# EasyEDA Pro project 1 Port AC Power Switch.eprj, board Single Port PCB Pro
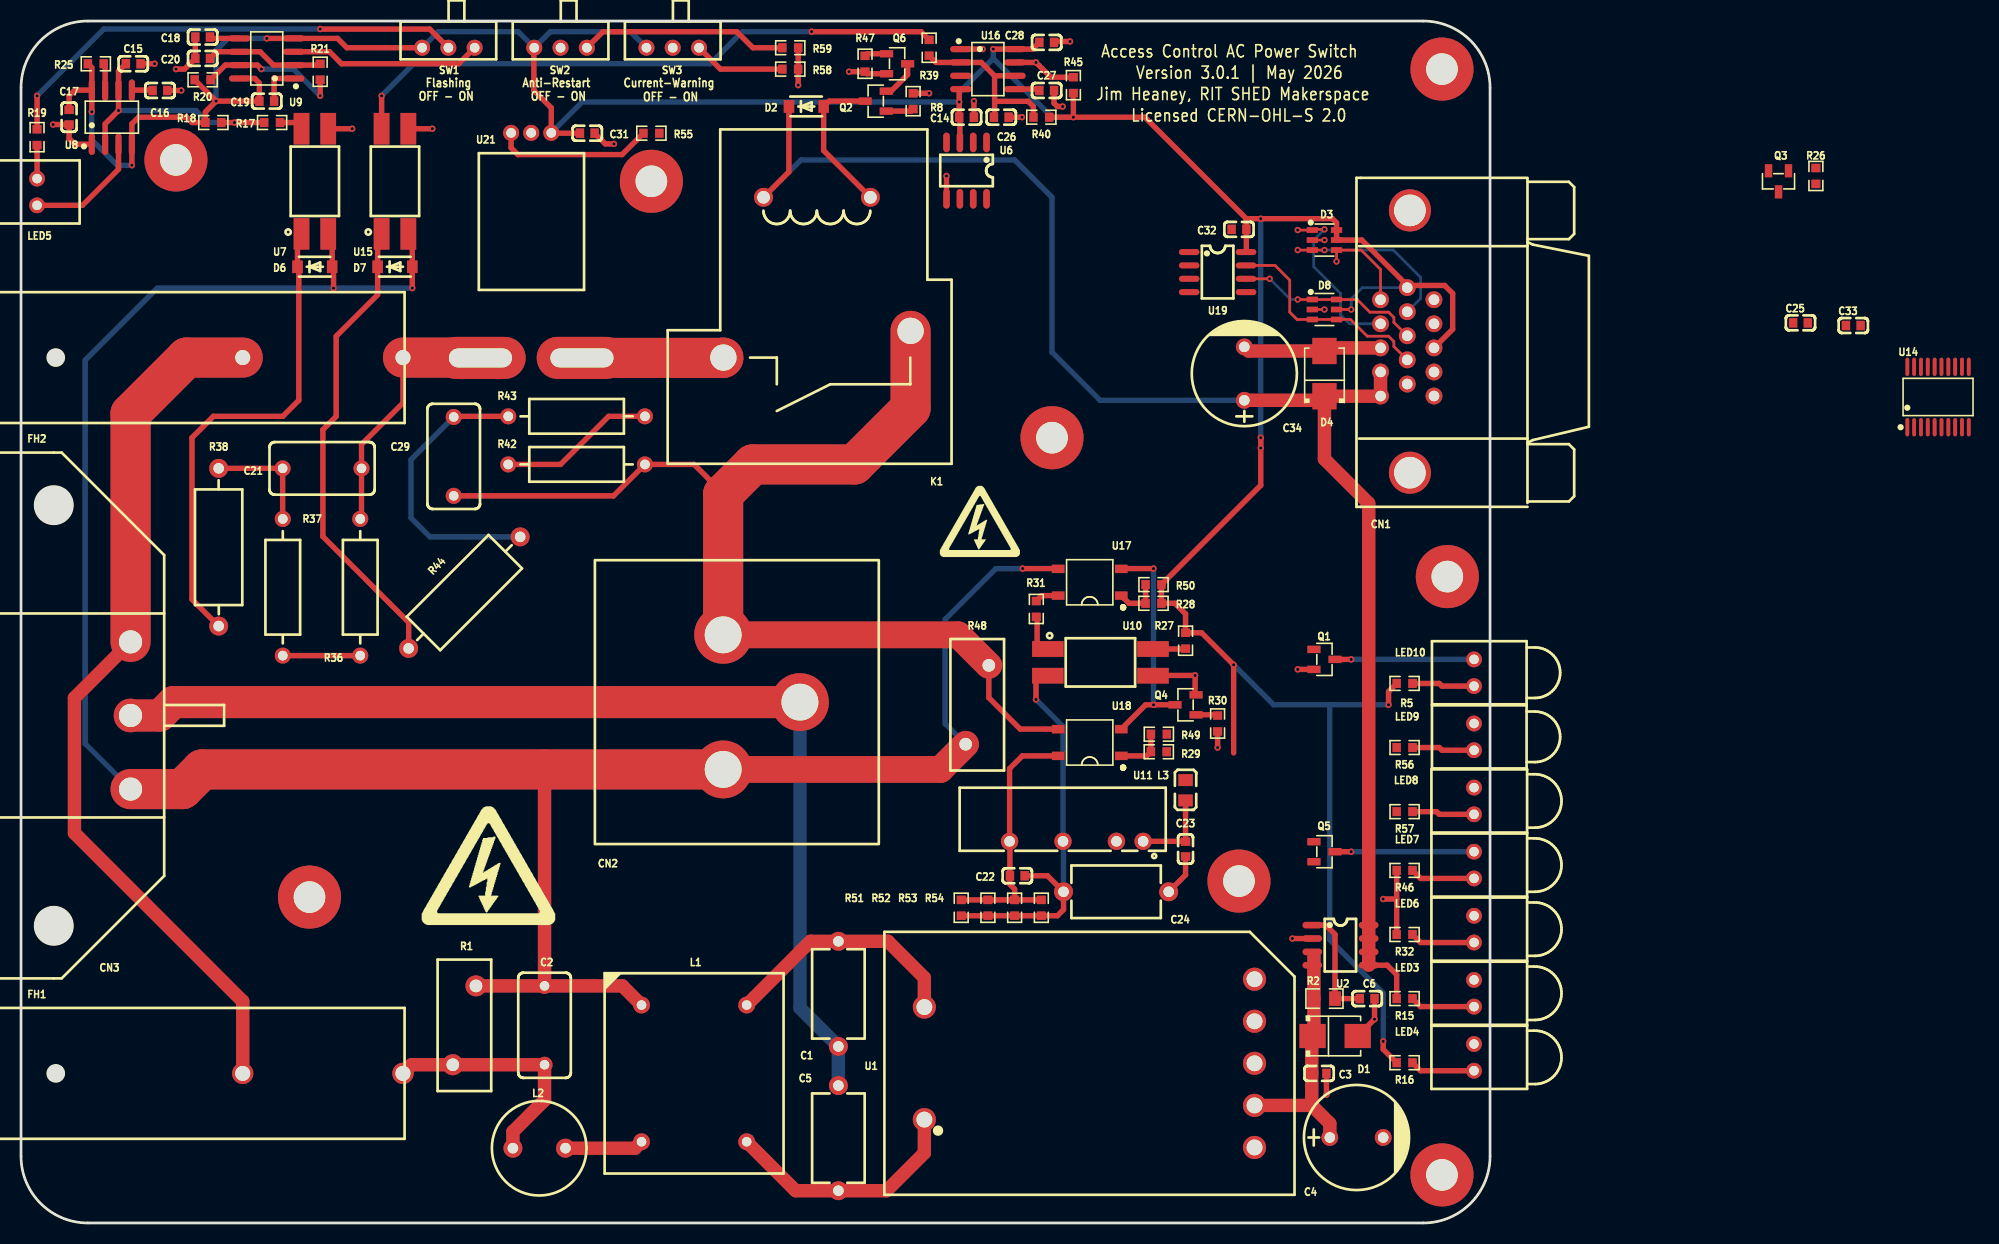
[diagram p12: board, top side]
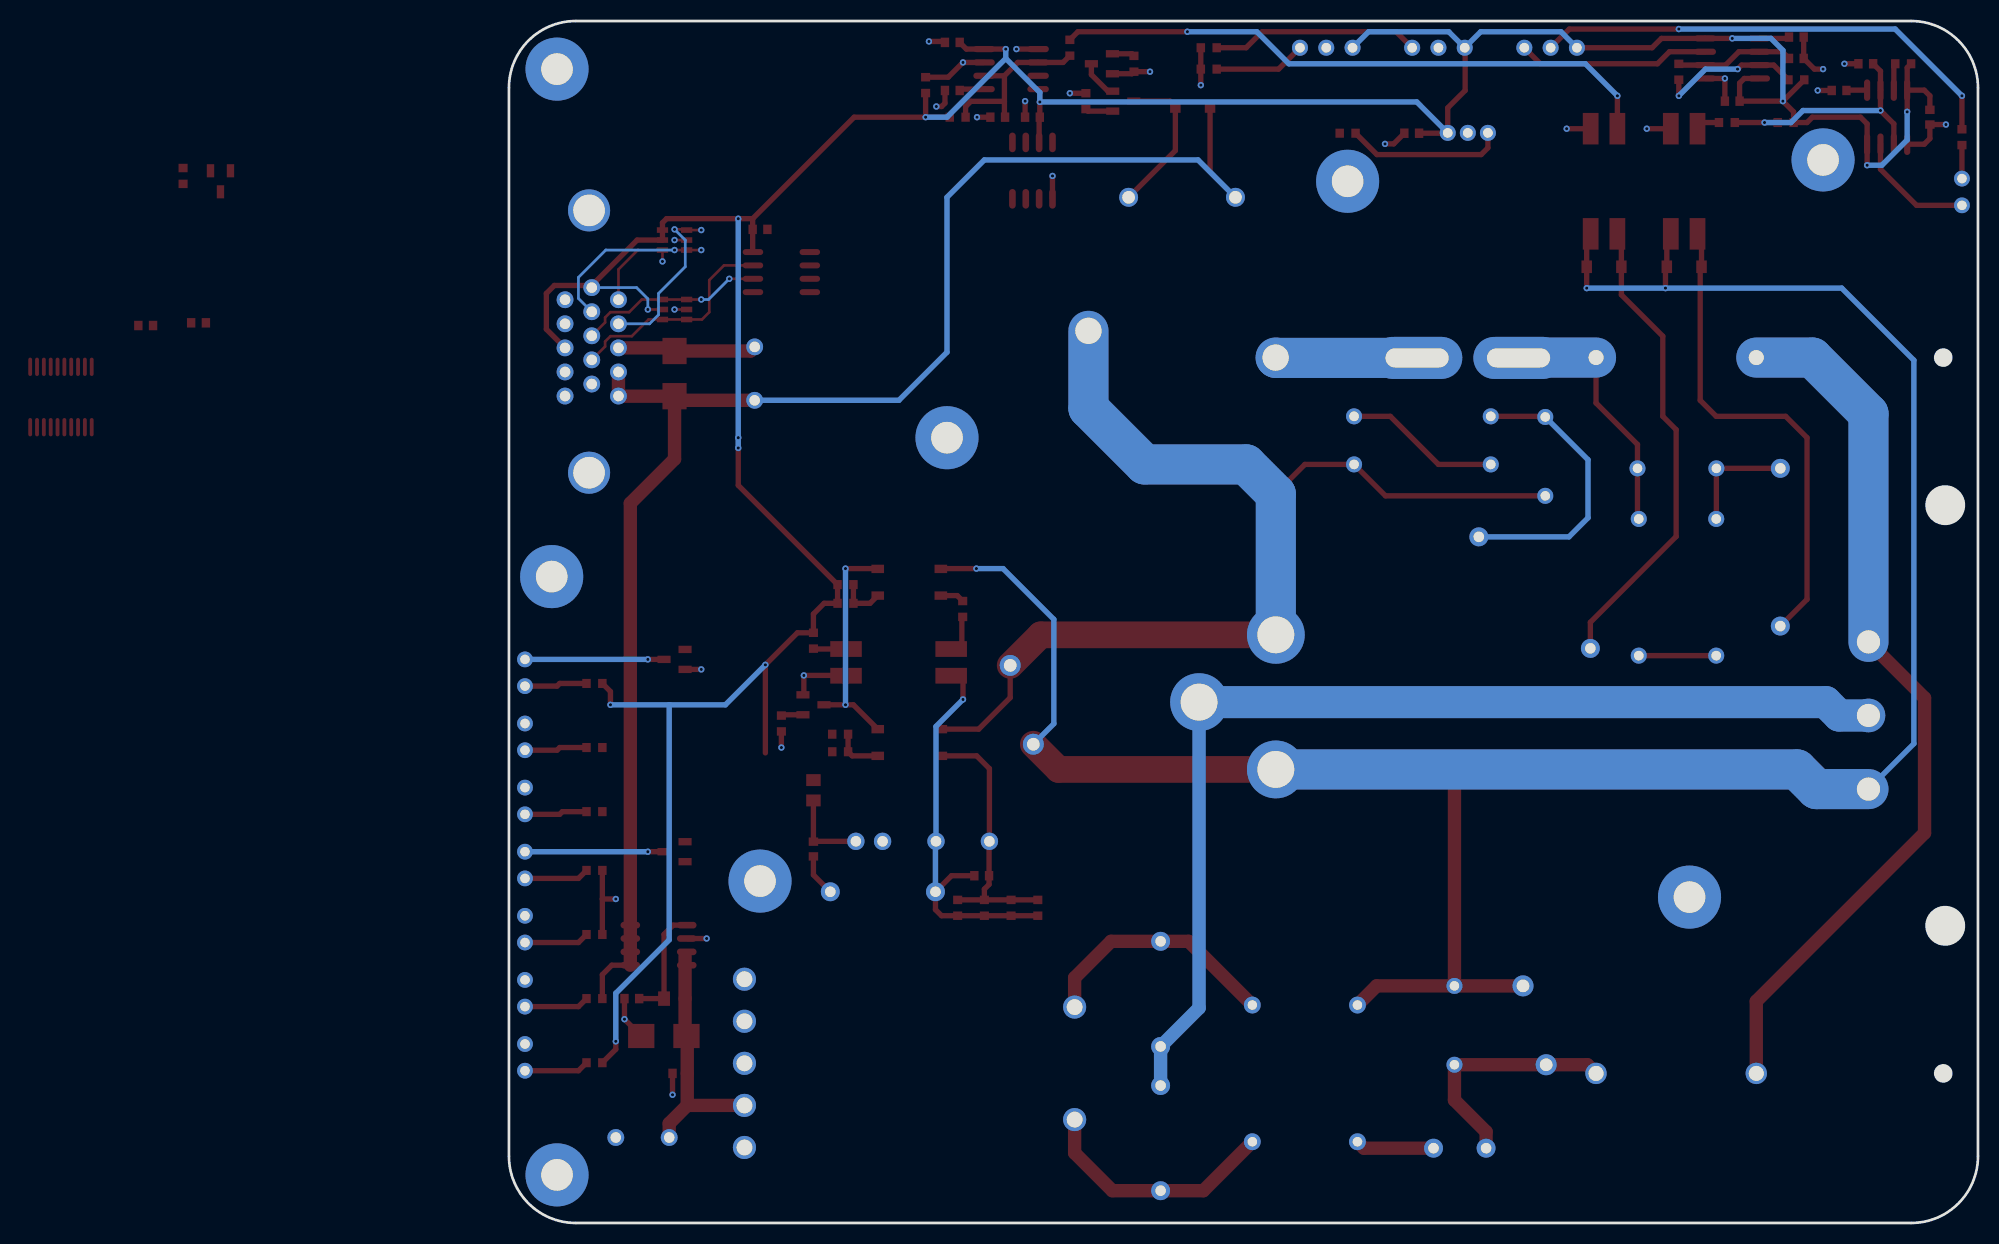
[diagram p13: board, bottom side, seen from below]

Outline 139.7 x 114.3 mm; copper layers: Top Layer, Bottom Layer. Coordinates in mm from the lower left corner of the outline.
Outline path: 0,107.95 0,6.35 arc(1.86,1.86) 6.35,0 133.35,0 arc(137.84,1.86) 139.7,6.35 139.7,107.95 arc(137.84,112.44) 133.35,114.3 6.35,114.3 arc(1.86,112.44) 0,107.95
Stack: Top Layer 0.035mm / Dielectric1 1.51mm FR4 er 4.5 / Bottom Layer 0.035mm

## Design rules (mm)
net NEUTRAL: HV Spacing
net FUSEDET: HV Spacing
template: Custom Config
spacing copperThickness1oz (default): track to track 0.102, other pairs 0.152 to 0.3
spacing copperThickness2oz: track to track 0.203, other pairs 0.152 to 0.3
track width copperThickness1oz (default): min 0.127, default 0.254, max 7.62
track width copperThickness2oz: min 0.203, default 0.254, max 2.54
differential pair differentialPair (default): width min 0.127, default 0.254, max 2.54; gap min 0.152, default 0.152
via viaSize (default): diameter min 0.5, default 0.61, max 10; hole min 0.3, default 0.305, max 6.3
net EARTH uses HV Space

## Placement (name value [footprint] x y rotation side)
C1  1nF  [CAP-TH_L8.5-W5.0-P10.00-D0.6]  77.73 21.78 90 top
C2  100nF  [CAP-TH_L10.0-W5.0-P7.50-D0.6]  49.78 18.8 90 top
C3  1uF  [C0603]  123.44 14.22 180 top
C4  470uF  [CAP-TH_BD10.0-P5.00-D1.0-FD]  127 8.13 0 top
C5  1nF  [CAP-TH_L8.5-W5.0-P10.00-D0.6]  77.73 8.07 90 top
C6  100nF  [C0603]  128.02 21.34 180 top
C14  100nF  [C0603]  89.92 105.16 180 top
C15  10uF  [C0603]  10.67 110.24 180 top
C16  100nF  [C0603]  13.21 107.7 180 top
C17  100nF  [C0603]  4.57 105.16 90 top
C18  100nF  [C0603]  17.27 112.78 0 top
C19  100nF  [C0603]  23.37 106.68 180 top
C20  10uF  [C0603]  17.27 110.74 0 top
C21  100nF  [CAP-TH_L10.0-W5.0-P7.50-D0.6]  28.63 71.76 0 top
C22  4.7uF  [C0603]  94.74 33.02 180 top
C23  10uF  [C0603]  110.74 35.56 90 top
C24  1nF  [CAP-TH_L8.5-W5.0-P10.00-D0.6]  104.14 31.5 0 top
C25  100nF  [C0603]  169.22 85.6 0 top
C26  10uF  [C0603]  93.22 105.16 180 top
C27  100nF  [C0603]  97.54 107.7 180 top
C28  100nF  [C0603]  97.54 112.27 180 top
C29  100nF  [CAP-TH_L10.0-W5.0-P7.50-D0.6]  41.15 72.9 270 top
C31  100nF  [C0603]  53.85 103.63 180 top
C32  100nF  [C0603]  115.82 94.49 0 top
C33  100nF  [C0603]  174.24 85.34 0 top
C34  470uF  [CAP-TH_BD10.0-P5.00-D1.0-FD]  116.33 80.77 90 top
CN1  DS1038-15FBNSiA74-0CC  [DSUB-TH_DS1038-15FBNSIA74-0CC]  131.83 83.82 90 top
CN2  a5006310303c48c0bbc049ad0b759426  [739W-X2/32]  74.07 49.53 270 top
CN3  IEC-EW-4  [CONN-TH_IEC-EW-4]  10.41 48.26 90 top
D1  SMBJ15A  [SMB_L4.3-W3.6-LS5.3-RD]  124.97 17.78 0 top
D2  SM4007PL  [SOD-123F_L2.8-W1.8-LS3.7-RD]  74.68 106.17 0 top
D3  SRV05-4A  [SOT-23-6_L2.9-W1.6-P0.95-LS2.9-BL]  123.95 93.47 270 top
D4  SMBJ15A  [SMB_L4.3-W3.6-LS5.3-RD]  123.95 80.77 90 top
D6  SM4007PL  [SOD-123F_L2.8-W1.8-LS3.7-RD]  27.94 90.93 0 top
D7  SM4007PL  [SOD-123F_L2.8-W1.8-LS3.7-RD]  35.56 90.93 0 top
D8  SRV05-4A  [SOT-23-6_L2.9-W1.6-P0.95-LS2.9-BL]  123.95 86.87 270 top
FH1  -  [03450101H]  28.7 14.22 0 top
FH2  -  [03450101H]  28.7 82.3 0 top
K1  HF2150-1A-12DE  [RELAY-TH_HF2150-1A]  75.69 89.92 180 top
L1  YDUU10.5-253L0321  [IND-TH_4P-L19.0-W17.0]  64.01 14.22 270 top
L2  470uH  [IND-TH_BD9.0-P5.00-D0.7]  49.28 7.11 0 top
L3  4.7uH  [L0805]  110.74 41.15 270 top
LED3  MHK1560UGBTD  [LED-TH_MHK1560UGBTD]  138.18 21.84 90 top
LED4  MHK1560UGBTD  [LED-TH_MHK1560UGBTD]  138.18 15.75 90 top
LED5  MHK1560CRBTD  [LED-TH_MHK1560UGBTD]  1.52 98.04 270 top
LED6  MHK1560CRBTD  [LED-TH_MHK1560UGBTD]  138.18 27.94 90 top
LED7  MHK1560CRBTD  [LED-TH_MHK1560UGBTD]  138.18 34.04 90 top
LED8  MHK1560CRBTD  [LED-TH_MHK1560UGBTD]  138.18 40.13 90 top
LED9  MHK1560CYBTD  [LED-TH_2P-L12.2-W6.0-P2.54_S530-A3]  138.18 46.23 90 top
LED10  MHK1560CYBTD  [LED-TH_2P-L12.2-W6.0-P2.54_S530-A3]  138.18 52.32 90 top
NOREF  -  [Pad_e203]  27.43 30.99 0 top
NOREF#2  -  [Pad_e449]  115.82 32.51 0 top
NOREF#3  -  [Pad_e33]  59.94 99.06 0 top
NOREF#4  -  [Pad_e487]  98.04 74.68 0 top
NOREF#5  -  [Pad_e938]  135.13 109.73 0 top
NOREF#6  -  [Pad_e53]  14.73 101.09 0 top
NOREF#7  -  [Pad_e953]  135.64 61.47 0 top
NOREF#8  -  [Pad_e937]  135.13 4.57 0 top
Q1  AO3400A  [SOT-23-3_L2.9-W1.3-P1.90-LS2.4-BR]  123.95 53.59 180 top
Q2  AO3400A  [SOT-23-3_L2.9-W1.3-P1.90-LS2.4-BR]  81.28 106.68 0 top
Q3  AO3400A  [SOT-23-3_L2.9-W1.3-P1.90-LS2.4-BR]  167.13 99.06 90 top
Q4  AO3400A  [SOT-23-3_L2.9-W1.3-P1.90-LS2.4-BR]  110.74 49.28 0 top
Q5  AO3400A  [SOT-23-3_L2.9-W1.3-P1.90-LS2.4-BR]  123.95 35.31 180 top
Q6  AO3400A  [SOT-23-3_L2.9-W1.3-P1.90-LS2.4-BR]  83.31 110.24 180 top
R1  210pF@1kHz  [RES-TH_L12.5-W5.1-P7.50-D1.2-S2.20]  42.16 18.8 90 top
R2  390Ω  [R0805]  123.95 21.34 180 top
R5  1kΩ  [R0603]  131.57 51.31 180 top
R8  10kΩ  [R0603]  84.84 106.68 270 top
R15  4.7kΩ  [R0603]  131.57 21.34 0 top
R16  1kΩ  [R0603]  131.57 15.24 180 top
R17  100Ω  [R0603]  23.88 104.65 180 top
R18  4.7kΩ  [R0603]  18.29 104.65 180 top
R19  1kΩ  [R0603]  1.52 103.25 90 top
R20  10kΩ  [R0603]  17.27 108.71 180 top
R21  20kΩ  [R0603]  28.45 109.47 270 top
R25  10kΩ  [R0603]  7.11 110.24 180 top
R26  10kΩ  [R0603]  170.69 99.57 90 top
R27  10kΩ  [R0603]  110.74 55.37 90 top
R28  1kΩ  [R0603]  107.7 58.93 0 top
R29  1kΩ  [R0603]  108.2 44.81 0 top
R30  10kΩ  [R0603]  113.79 47.5 90 top
R31  1kΩ  [R0603]  96.55 58.39 270 top
R32  1kΩ  [R0603]  131.57 27.43 180 top
R36  470kΩ  [RES-TH_BD3.3-L9.0-P13.00-D0.6]  32.26 60.45 270 top
R37  470kΩ  [RES-TH_BD3.3-L9.0-P13.00-D0.6]  24.89 60.45 90 top
R38  4.7kΩ  [RES-TH_BD4.5-L11.0-P15.00-D0.7]  18.8 64.26 270 top
R39  100Ω  [R0603]  86.36 111.76 270 top
R40  4.7kΩ  [R0603]  97.03 105.16 0 top
R42  470kΩ  [RES-TH_BD3.3-L9.0-P13.00-D0.6]  52.83 72.14 180 top
R43  470kΩ  [RES-TH_BD3.3-L9.0-P13.00-D0.6]  52.83 76.71 180 top
R44  4.7kΩ  [RES-TH_BD4.5-L11.0-P15.00-D0.7]  42.16 59.94 225 top
R45  10kΩ  [R0603]  100.08 108.2 270 top
R46  1kΩ  [R0603]  131.57 33.53 180 top
R47  10kΩ  [R0603]  80.26 110.24 90 top
R48  210pF@1kHz  [RES-TH_L12.5-W5.1-P7.50-D1.2-S2.20]  90.93 49.28 90 top
R49  1kΩ  [R0603]  108.2 46.48 0 top
R50  1kΩ  [R0603]  107.7 60.71 0 top
R51  1kΩ  [R0603]  89.41 29.97 90 top
R52  1kΩ  [R0603]  91.95 29.97 90 top
R53  1kΩ  [R0603]  94.49 29.97 90 top
R54  1kΩ  [R0603]  97.03 29.97 90 top
R55  1kΩ  [R0603]  59.94 103.63 180 top
R56  1kΩ  [R0603]  131.57 45.21 180 top
R57  1kΩ  [R0603]  131.57 39.12 180 top
R58  10kΩ  [R0603]  73.15 109.73 180 top
R59  10kΩ  [R0603]  73.15 111.76 180 top
SW1  MSK12D18G2 125  [SW-TH_MSK12D18G2]  40.64 111.76 180 top
SW2  MSK12D18G2 125  [SW-TH_MSK12D18G2]  51.31 111.76 180 top
SW3  MSK12D18G2 125  [SW-TH_MSK12D18G2]  61.98 111.76 180 top
U1  TAS20-12-W2  [PWRM-TH_4P-L39.0-W25.0_TAS12-15-W2]  101.6 15.18 0 top
U2  MX5052S  [SOP-8_L4.9-W3.9-P1.27-LS6.0-BL]  125.48 26.42 270 top
U6  DS18B20Z(UMW)  [SOP-8_L4.9-W3.9-P1.27-LS6.0-BL]  89.92 100.08 180 top
U7  LTV-817S-TA1-C  [OPTO-SMD-4_L4.6-W6.5-P2.54-LS10.3-BL]  27.94 99.06 0 top
U8  NE555DR  [SOIC-8_L4.9-W3.9-P1.27-LS6.0-BL]  8.64 105.16 0 top
U9  NE555DR  [SOIC-8_L4.9-W3.9-P1.27-LS6.0-BL]  23.37 110.74 90 top
U10  LTV-817S-TA1-C  [OPTO-SMD-4_L4.6-W6.5-P2.54-LS10.3-BL]  102.65 53.31 270 top
U11  300kHz  [PWRM-TH_4P-L19.7-W6.0-P2.54]  100.36 36.29 180 top
U14  STM8S003F3P6TR  [TSSOP-20_L6.5-W4.4-P0.65-LS6.4-BL]  182.3 78.55 0 top
U15  LTV-817S-TA1-C  [OPTO-SMD-4_L4.6-W6.5-P2.54-LS10.3-BL]  35.56 99.06 0 top
U16  NE555DR  [SOIC-8_L4.9-W3.9-P1.27-LS6.0-BL]  91.95 109.73 270 top
U17  GAQY216S  [SOP-4_L4.3-W4.4-P2.54-LS6.8-TR]  101.63 60.93 270 top
U18  GAQY216S  [SOP-4_L4.3-W4.4-P2.54-LS6.8-TR]  101.63 45.69 270 top
U19  SP485EEN-L/TR  [SOIC-8_L5.0-W4.0-P1.27-LS6.0-BL]  113.79 90.42 270 top
U21  ACS758LCB-050B-PFF-T  [SENSOR-TH_ACS758LCB-050B-PFF-T]  48.51 92.96 180 top

## Footprints (pads in the part's own frame, mm; a bottom-side part is the same pattern mirrored in y, then rotated)
739W-X2/32
  round 5.5 hole 3.5: 1(6.4,-7.3) 2(-6.4,-7.3) 3(0,0)
03450101H
  round 2.032 hole 1.423: 1(7.62,0) 2(-7.62,0)
C0603
  rect 0.8x0.9 smd: 1(-0.7,0) 2(0.7,0)
CAP-TH_BD10.0-P5.00-D1.0-FD
  round 1.6 hole 1: 1(-2.54,0) 2(2.54,0)
CAP-TH_L8.5-W5.0-P10.00-D0.6
  round 1.8 hole 1: 1(-5,0) 2(5,0)
CAP-TH_L10.0-W5.0-P7.50-D0.6
  round 1.524 hole 0.9: 1(-3.75,0) 2(3.75,0)
CONN-TH_IEC-EW-4
  round 3.2 hole 2.2: 1(-7,0) 2(0,0) 3(7,0)
DSUB-TH_DS1038-15FBNSIA74-0CC
  round 1.6 hole 1: 1(3.978,2.54) 2(1.688,2.54) 3(-0.603,2.54) 4(-2.893,2.54) 5(-5.182,2.54) 6(5.128,0) 7(2.837,0) 8(0.548,0) 9(-1.743,0) 10(-4.042,0) 11(3.978,-2.54) 12(1.688,-2.54) 13(-0.603,-2.54) 14(-2.893,-2.54) 15(-5.182,-2.54)
  round 4 hole 3: 16(12.473,-0.254) 17(-12.473,-0.254)
IND-TH_4P-L19.0-W17.0
  round 1.6 hole 0.9: 1(-6.5,-5) 2(6.5,-5) 3(-6.5,5) 4(6.5,5)
IND-TH_BD9.0-P5.00-D0.7
  round 1.8 hole 1: 1(-2.5,0) 2(2.5,0)
L0805
  rect 1.133x1.377 smd: 1(-0.966,0) 2(0.966,0)
LED-TH_2P-L12.2-W6.0-P2.54_S530-A3
  round 1.5 hole 0.9: 1(-1.27,0) 2(1.27,0)
LED-TH_MHK1560UGBTD
  round 1.5 hole 0.9: 1(1.27,0) 2(-1.27,0)
OPTO-SMD-4_L4.6-W6.5-P2.54-LS10.3-BL
  rect 1.5x3 smd: 1(-1.27,-5) 2(1.27,-5) 3(1.27,5) 4(-1.27,5)
Pad_e33
  round 6 hole 3: 1(0,0)
Pad_e53
  round 6 hole 3: 1(0,0)
Pad_e203
  round 6 hole 3: 1(0,0)
Pad_e449
  round 6 hole 3: 1(0,0)
Pad_e487
  round 6 hole 3: 1(0,0)
Pad_e937
  round 6 hole 3: 1(0,0)
Pad_e938
  round 6 hole 3: 1(0,0)
Pad_e953
  round 6 hole 3: 1(0,0)
PWRM-TH_4P-L19.7-W6.0-P2.54
  round 1.65 hole 1: 1(-6.35,0) 2(-3.81,0) 4(1.27,0) 6(6.35,0)
PWRM-TH_4P-L39.0-W25.0_TAS12-15-W2
  round 2.2 hole 1.5: 1(-15.7,-5.35) 2(-15.7,5.35) 3(15.7,8) 4(15.7,4) 5(15.7,0) 6(15.7,-4) 7(15.7,-8)
R0603
  rect 0.806x0.864 smd: 1(-0.753,0) 2(0.753,0)
R0805
  rect 1.133x1.377 smd: 1(-1,0) 2(1,0)
RELAY-TH_HF2150-1A
  round 1.8 hole 1.2: 1(-5.08,-7.62) 2(5.08,-7.62)
  round 3.5 hole 2.5: 3(8.9,7.62) 4(-8.9,5.08)
RES-TH_BD3.3-L9.0-P13.00-D0.6
  round 1.524 hole 0.914: 1(-6.5,0) 2(6.5,0)
RES-TH_BD4.5-L11.0-P15.00-D0.7
  round 1.8 hole 1: 1(-7.5,0) 2(7.5,0)
RES-TH_L12.5-W5.1-P7.50-D1.2-S2.20
  round 2 hole 1.2: 1(-3.749,1.1) 2(3.749,-1.1)
SENSOR-TH_ACS758LCB-050B-PFF-T
  round 1.524 hole 0.914: 1(-1.91,-10.7) 2(0,-10.7) 3(1.91,-10.7)
  oval 8.6x4 hole 6x1.8: 4(4.826,10.7) 5(-4.826,10.7)
SMB_L4.3-W3.6-LS5.3-RD
  rect 2.5x2.3 smd: 1(-2.15,0) 2(2.15,0)
SOD-123F_L2.8-W1.8-LS3.7-RD
  rect 1x1.2 smd: 1(-1.65,0) 2(1.65,0)
SOIC-8_L4.9-W3.9-P1.27-LS6.0-BL
  oval 0.588x2.045 smd: 1(-1.905,-2.57) 2(-0.635,-2.57) 3(0.635,-2.57) 4(1.905,-2.57) 5(1.905,2.57) 6(0.635,2.57) 7(-0.635,2.57) 8(-1.905,2.57)
SOIC-8_L5.0-W4.0-P1.27-LS6.0-BL
  oval 0.569x1.95 smd: 1(-1.905,-2.705) 2(-0.635,-2.705) 3(0.635,-2.705) 4(1.905,-2.705) 5(1.905,2.705) 6(0.635,2.705) 7(-0.635,2.705) 8(-1.905,2.705)
SOP-4_L4.3-W4.4-P2.54-LS6.8-TR
  rect 0.8x1.2 smd: 1(1.27,3) 2(-1.27,3) 3(-1.27,-3) 4(1.27,-3)
SOP-8_L4.9-W3.9-P1.27-LS6.0-BL
  oval 0.63x1.865 smd: 1(-1.905,-2.683) 2(-0.635,-2.683) 3(0.635,-2.683) 4(1.905,-2.683) 5(1.905,2.683) 6(0.635,2.683) 7(-0.635,2.683) 8(-1.905,2.683)
SOT-23-3_L2.9-W1.3-P1.90-LS2.4-BR
  rect 1.25x0.7 smd: 1(1,-0.95) 2(1,0.95) 3(-1,0)
SOT-23-6_L2.9-W1.6-P0.95-LS2.9-BL
  rect 0.532x1.072 smd: 1(-0.95,-1.149) 2(0,-1.149) 3(0.95,-1.149) 4(0.95,1.149) 5(0,1.149) 6(-0.95,1.149)
SW-TH_MSK12D18G2
  round 1.524 hole 0.914: 1(-2.5,0) 2(0,0) 3(2.5,0)
TSSOP-20_L6.5-W4.4-P0.65-LS6.4-BL
  oval 0.364x1.742 smd: 1(-2.925,-2.871) 2(-2.275,-2.871) 3(-1.625,-2.871) 4(-0.975,-2.871) 5(-0.325,-2.871) 6(0.325,-2.871) 7(0.975,-2.871) 8(1.625,-2.871) 9(2.275,-2.871) 10(2.925,-2.871) 11(2.925,2.871) 12(2.275,2.871) 13(1.625,2.871) 14(0.975,2.871) 15(0.325,2.871) 16(-0.325,2.871) 17(-0.975,2.871) 18(-1.625,2.871) 19(-2.275,2.871) 20(-2.925,2.871)

## Nets
As in the schematic.

Pads without a net: CN1 12 15 16 17; NOREF 1; NOREF#2 1; NOREF#3 1; NOREF#4 1; NOREF#5 1; NOREF#6 1; NOREF#7 1; NOREF#8 1; U1 3 5 7; U6 1 2 6 7 8; U14 1 2 3 4 5 6 7 8 9 10 11 12 13 14 15 16 17 18 19 20

## Via types
v1: diameter 0.61, hole 0.305, Top Layer to Bottom Layer, 64 vias

## Routing (per net, layer and track width the routed paths; a pad name or vN(x,y) marks a point on that pad's centre or on a via; arc(x,y) is an arc through that point)
+5V: length 348.9
  Top Layer w0.254: D8.5 v1(126.49,86.87)
  Top Layer w0.508: v1(117.89,74.68) v1(117.89,73.7) 117.89,70.15 R50.2 R28.2 109.73,58.93 110.74,57.91 R27.2 112.27,56.13 v1(115.32,53.08) 115.32,44.7 ; v1(130.05,49.28) 130.05,50.54 R5.2 ; v1(18.55,106.68) 17.53,105.66 R18.2 16.26,104.65 15.75,105.16 11.18,105.16 10.54,104.52 U8.4 v1(10.54,100.58) ; v1(18.55,106.68) R20.2 ; v1(18.55,106.68) C19.2 22.67,108.4 22.22,108.84 U9.8 ; SW2.3 48.77,111.72 48.77,107.7 50.42,106.04 U21.1 50.46,103.63 C31.2 ; 116.52,95.5 106.87,105.16 v1(100.08,105.16) ; 116.52,95.5 v1(117.89,95.5) 124.71,95.5 125.1,95.12 D3.6 D3.5 127.51,93.47 131.83,89.15 CN1.6 132.03,89.15 135.38,89.15 136.14,88.39 136.14,85 CN1.13 ; 116.52,95.5 C32.2 116.52,92.36 116.5,92.33 ; C17.2 4.57,107.19 5.11,107.73 U8.8 ; v1(100.08,105.16) R40.2 ; v1(100.08,105.16) R45.2 ; R16.2 129.54,16.52 v1(129.54,17.27) ; v1(23.37,112.65) U9.4 30.1,112.65 30.99,111.76 SW1.3 ; U8.8 v1(6.73,105.66) ; U8.8 6.73,109.86 R25.2 ; C28.2 96.2,111.63 U16.8 v1(92.46,111.63) ; U6.3 89.28,105.09 C14.2 v1(89.22,106.6) 89.22,107.66 U16.4
  Bottom Layer w0.254: v1(126.49,86.87) 126.49,87.88 127.56,88.95 CN1.6
  Bottom Layer w0.508: v1(23.37,112.65) 19.69,112.65 18.55,111.51 v1(18.55,106.68) ; 92.46,110.74 89.22,107.5 v1(89.22,106.6) 53.36,106.6 U21.1 ; 92.46,110.74 v1(92.46,111.63) ; 92.46,110.74 98.04,105.16 v1(100.08,105.16) ; v1(10.54,100.58) 9.14,100.58 6.73,103 v1(6.73,105.66) ; 124.46,49.28 119.12,49.28 v1(115.32,53.08) ; 124.46,49.28 124.46,26.92 129.54,21.84 v1(129.54,17.27) ; 124.46,49.28 v1(130.05,49.28) ; SW1.3 39.66,113.28 47.28,113.28 SW2.3 50.33,113.28 57.95,113.28 SW3.3 ; v1(117.89,73.7) v1(117.89,74.68) v1(117.89,95.5)
+12V: length 151.5
  Top Layer w0.508: U2.5 129.92,24.51 130.82,23.61 R15.1 ; D2.1 73.03,99.95 K1.2
  Top Layer w1.27: D4.1 123.95,72.64 128.16,68.44 U2.8 U2.7 U2.6 U2.5 ; D4.1 123.56,78.23 C34.1 ; D4.1 129.27,78.62 CN1.5 CN1.4
  Bottom Layer w0.508: K1.2 74.17,101.09 94.49,101.09 98.04,97.54 98.04,82.8 102.62,78.23 C34.1
GND: length 79.2
  Top Layer w0.254: D8.2 v1(123.95,86.87) ; D3.2 v1(123.95,93.47)
  Top Layer w0.508: C15.1 v1(12.7,110.24) ; U2.2 v1(120.9,27.05) ; C31.1 55.56,102.62 v1(56.39,102.62) ; Q6.2 80.46,109.29 R47.1 v1(78.74,109.48) ; U9.1 v1(24.07,108.84) C19.1 ; v1(99.06,106.17) 98.55,106.17 98.24,106.49 C27.1 ; U10.3 107.68,52.07 v1(111.66,52.07) 111.66,50.31 Q4.2 ; v1(73.91,108.2) R58.1 R59.1 ; U7.3 v1(31.5,104.06) ; C26.1 v1(95.19,105.16) ; v1(3.05,104.46) C17.1 4.57,103.12 5.11,102.59 U8.1 ; D1.2 v1(128.72,19.38) C6.1 ; C24.2 110.74,33.1 C23.1 ; C16.1 v1(15.24,107.7) ; v1(99.76,112.36) 98.33,112.36 C28.1 ; Q1.2 v1(121.41,52.64) ; U6.5 v1(88.01,99.57) ; R8.1 v1(86.36,107.43) ; U16.1 v1(91.44,111.63) ; U15.3 v1(39.12,104.06) ; v1(14.73,109.73) 15.56,109.73 C20.1 C18.1 ; C3.1 v1(124.14,12.19) ; C14.1 v1(90.62,106.68) ; R30.1 v1(113.79,45.21)
  Top Layer w1.27: C34.2 116.72,82.92 D4.2 124.25,83.22 CN1.3
485-A: length 17.8
  Top Layer w0.254: CN1.8 130.56,85.64 130.56,86.11 130.05,86.61 128.27,86.61 127.07,87.82 D8.6 D8.1 v1(121.41,87.82) ; v1(118.75,89.79) U19.6
  Bottom Layer w0.254: v1(121.41,87.82) 120.72,87.82 v1(118.75,89.79)
485-B: length 21.1
  Top Layer w0.254: U19.7 119.25,91.06 120.65,89.66 120.65,86.61 121.35,85.92 D8.3 D8.4 126.43,85.92 128.02,84.33 130.05,84.33 130.56,83.82 130.56,83.35 CN1.9
ACCESS: length 11
  Top Layer w0.254: v1(125.1,91.44) D3.4 127.44,92.52 129.29,90.68 CN1.1
  Top Layer w0.508: R47.2 80.46,111.19 Q6.1
EARTH: length 166.3
  Top Layer w3.048: CN3.2 13.21,48.26 14.48,49.53 CN2.3
  Bottom Layer w1.27: C5.2 C1.1 74.07,20.44 CN2.3
  Bottom Layer w3.048: CN3.2 13.21,48.26 14.48,49.53 CN2.3
FLASH-SOURCE: length 18.3
  Top Layer w0.508: SW1.1 41.62,110.24 30.48,110.24 29.34,111.38 U9.3
FLASHING: length 53
  Top Layer w0.508: R19.2 v1(1.52,107.19) ; R32.2 130.82,30.81 ; 130.82,30.81 v1(129.54,30.81) ; 130.82,30.81 R46.2 ; SW1.2 38.86,113.54 v1(28.45,113.54)
  Bottom Layer w0.508: v1(28.45,113.54) 7.87,113.54 v1(1.52,107.19)
FUSE-BLOWN: length 2.6
  Top Layer w0.508: U8.7 8,110.1 R25.1
FUSEDET: length 31.8
  Top Layer w0.508: R36.1 32.38,67.07 C21.2 32.38,74.03 36.32,77.98 FH2.1
  Top Layer w3.81: FH2.1 43.66,82.3 U21.4
  Bottom Layer w3.81: FH2.1 43.66,82.3 U21.4
INTERRUPT: length 16.5
  Top Layer w0.254: v1(123.95,92.52) D3.3 v1(121.41,92.52)
  Bottom Layer w0.254: v1(123.95,92.52) 130.49,92.52 133.1,89.92 133.1,87.93 CN1.7
ISO-5V: length 25.5
  Top Layer w0.508: R53.2 R54.2 ; R53.2 94.49,31.75 94.04,32.2 C22.2 94.04,36.26 U11.6 ; R53.2 R52.2 R51.2 ; U18.4 95.22,44.42 94.01,43.21 U11.6 ; 93.98,36.26 U11.6
ISO-GND: length 37.7
  Top Layer w0.508: v1(96.52,49.78) 96.52,51.93 96.63,52.04 ; C22.1 97.62,33.02 C24.1 99.14,29.8 98.56,29.22 R54.1 R53.1 R52.1 R51.1
  Bottom Layer w0.508: v1(96.52,49.78) 99.09,47.21 U11.4 99.14,36.24 C24.1
LIVE: length 119
  Top Layer w1.27: CN3.3 5.08,49.93 5.08,37.08 21.08,21.08 FH1.2
  Top Layer w3.81: FH2.2 15.75,82.3 10.41,76.96 CN3.3
  Bottom Layer w3.81: FH2.2 15.75,82.3 10.41,76.96 CN3.3
MCU-SWITCH: length 2.6
  Top Layer w0.508: Q2.1 84.64,105.73 R8.2
NEUTRAL: length 288.1
  Top Layer w0.508: v1(37.21,88.9) D7.2 37.21,93.68 U15.2 ; v1(29.72,88.9) 29.72,90.8 D6.2 29.59,93.68 U7.2 ; U17.3 98.6,62.23 v1(95.25,62.23)
  Top Layer w1.27: R1.2 49.78,22.54 ; L1.1 57.19,22.55 C2.2 49.78,43.18
  Top Layer w2.54: CN2.1 87.44,43.13 R48.1
  Top Layer w3.81: CN2.1 17.22,43.13 15.35,41.26 CN3.1
  Bottom Layer w0.508: R48.1 87.88,47.47 87.88,57.4 92.71,62.23 v1(95.25,62.23) ; CN3.1 6.1,45.58 6.1,82.04 12.95,88.9 v1(29.72,88.9) v1(37.21,88.9)
  Bottom Layer w3.81: CN2.1 17.22,43.13 15.35,41.26 CN3.1
ONEWIRE: length 16.3
  Top Layer w0.254: v1(123.95,94.49) 122.87,94.49 D3.1 v1(121.41,94.42)
  Bottom Layer w0.254: CN1.2 126.33,85.51 125.48,86.36 125.48,88.39 122.94,90.93 122.94,93.47 v1(123.95,94.49)
SWITCH-ISO: length 2.1
  Top Layer w0.508: Q4.1 113.72,48.33 R30.2
SWITCH-ON: length 3.1
  Top Layer w0.508: U10.4 110.71,54.58 R27.1
WELD-DET: length 149.7
  Top Layer w0.508: C29.2 56.34,69.15 R42.1 64.01,72.14 67.06,69.09 ; U18.3 95.03,46.96 92.03,49.95 R48.2
  Top Layer w2.54: R48.2 89.13,55.93 CN2.2
  Top Layer w3.81: K1.4 84.59,77.48 79.25,72.14 69.6,72.14 66.77,69.31 CN2.2
  Bottom Layer w3.81: K1.4 84.59,77.48 79.25,72.14 69.6,72.14 66.77,69.31 CN2.2
WELDED: length 6.1
  Top Layer w0.508: U16.7 v1(96.52,110.36) 97.93,108.96 R45.1
$1N1792: length 14.6
  Top Layer w0.508: K1.1 76.33,101.98 D2.2 76.83,106.68 Q2.3
$1N3074: length 23.6
  Top Layer w1.27: L1.3 75.07,26.78 C1.2 82.44,26.78 85.9,23.32 U1.2
$1N3080: length 23.5
  Top Layer w1.27: U1.1 85.9,6.66 82.32,3.07 C5.1 73.66,3.07 L1.4
$1N3148: length 23.5
  Top Layer w1.27: 122.95,25.4 R2.2 122.95,17.91 D1.1 122.74,17.71 C3.2 122.74,11.18 ; 122.74,11.18 U1.6 ; 122.74,11.18 124.46,9.46 C4.1
$1N3585: length 11
  Top Layer w0.508: U2.1 124.08,28.32 124.95,27.45 R2.1 C6.2
$1N20815: length 23
  Top Layer w1.27: 49.78,15.05 R1.1 37.14,15.05 FH1.1 ; C2.1 49.78,11.68 46.78,8.68 L2.1
$1N20816: length 7.5
  Top Layer w1.27: L1.2 58.4,7.11 L2.2
$1N22595: length 6.2
  Top Layer w0.508: R15.2 133.09,20.57 LED3.2
$1N27753: length 3.7
  Top Layer w0.508: Q6.3 84.31,109.2 82.74,107.63 Q2.2
$1N27894: length 26.9
  Top Layer w3.81: U21.5 66.76,82.26 K1.3
  Bottom Layer w3.81: U21.5 66.76,82.26 K1.3
$1N29987: length 15.1
  Top Layer w0.508: U21.3 46.6,102.24 47.24,101.6 57.16,101.6 R55.2
$2N1040: length 3.2
  Top Layer w0.508: LED5.2 1.52,102.5
$2N1041: length 11.6
  Top Layer w0.508: LED5.1 5.84,96.77 9.27,100.2 U8.3
$2N1042: length 2
  Top Layer w0.508: U8.5 12.48,107.73 C16.2
$2N1044: length 24
  Top Layer w0.508: R18.1 v1(20.3,104.65) R17.2 ; U8.2 8,104.52 v1(9.27,105.79) U8.6 9.27,109.54 C15.2
  Bottom Layer w0.508: v1(20.3,104.65) 17.78,104.65 16.64,105.79 v1(9.27,105.79)
$2N1059: length 2.3
  Top Layer w0.508: R17.1 26.08,104.65 U7.4
$2N1063: length 46.6
  Top Layer w0.508: R38.2 16.26,59.3 16.26,74.68 18.29,76.71 24.89,76.71 26.42,78.23 26.42,90.81 D6.1 26.29,93.68 U7.1
$2N2500: length 7.4
  Top Layer w0.508: R36.2 R37.1
$2N2514: length 10.9
  Top Layer w0.508: R37.2 24.88,66.97 C21.1 24.88,71.76 R38.1
$2N3110: length 13.7
  Top Layer w0.508: R20.1 19.42,110.11 U9.7 22.48,110.11 v1(22.86,109.73) ; v1(28.45,107.19) R21.2
  Bottom Layer w0.508: v1(22.86,109.73) 25.91,109.73 v1(28.45,107.19)
$2N3114: length 2.9
  Top Layer w0.508: U9.5 18.1,112.65 C18.2
$2N3115: length 11.3
  Top Layer w0.508: C20.2 18.61,111.38 U9.6 22.73,111.38 24,110.11 U9.2 28.33,110.11 R21.1
$3N811: length 6.2
  Top Layer w0.508: LED4.2 133.09,14.48 R16.1
$3N3927: length 6
  Top Layer w0.508: R5.1 134.87,51.31 135.13,51.05 LED10.1
$3N3929: length 13
  Top Layer w0.508: 125.21,53.59 v1(126.49,53.59)
  Bottom Layer w0.508: v1(126.49,53.59) LED10.2
$3N4280: length 19.9
  Top Layer w0.508: R59.2 69.6,111.76 68.07,113.28 55.33,113.28 SW2.1
$3N4284: length 8.8
  Top Layer w0.508: R58.2 66.51,109.73 SW3.1
$4N1779: length 6
  Top Layer w0.508: LED9.1 135.13,44.96 134.87,45.21 R56.1
$4N1823: length 6
  Top Layer w0.508: R57.1 134.62,39.12 134.87,38.86 LED8.2
$5N601: length 4.4
  Top Layer w0.508: R50.1 R28.1 105.36,58.93 U17.1
$5N659: length 4.7
  Top Layer w0.508: U18.1 107.06,44.42 R29.1 107.45,44.81 R49.1
$5N709: length 22.1
  Top Layer w0.508: Q4.3 v1(107.7,49.28) 106.95,49.28 U18.2 ; U17.2 104.66,62.23 v1(107.7,62.23)
  Bottom Layer w0.508: v1(107.7,49.28) v1(107.7,62.23)
$5N916: length 3.1
  Top Layer w0.508: R31.2 96.63,57.56 96.63,54.58
$5N1162: length 8
  Top Layer w0.508: L3.2 C23.2 110.71,36.29 U11.1
$5N1411: length 6.2
  Top Layer w0.508: LED6.2 133.09,26.67 R32.1
$5N3978: length 2.3
  Top Layer w0.508: U17.4 97.07,59.66 R31.1
$7N1010: length 45.1
  Top Layer w0.508: R44.2 36.86,57.12 28.7,65.28 28.7,75.44 29.97,76.71 29.97,84.33 33.91,88.27 D7.1 33.91,93.68 U15.1
$7N1018: length 2.4
  Top Layer w0.508: U16.5 96.71,107.82 C27.2
$7N1023: length 27.6
  Top Layer w0.508: C29.1 41.21,76.71 R43.2
  Bottom Layer w0.508: C29.1 37.08,72.58 37.08,67.06 38.89,65.25 R44.1
$7N1029: length 14.9
  Top Layer w0.508: R42.2 51.31,72.14 55.88,76.71 R43.1
$7N1032: length 58
  Top Layer w0.508: U15.4 v1(34.29,107.19) ; v1(75.18,113.28) 85.59,113.28 R39.1
  Bottom Layer w0.508: v1(75.18,113.28) 68.58,113.28 65.53,110.24 37.34,110.24 v1(34.29,107.19)
$7N1035: length 17.6
  Top Layer w0.508: R40.1 96.27,106.16 95.77,106.67 92.58,106.67 ; 92.58,105.34 92.58,106.67 ; 92.58,106.67 92.58,109.09 ; 92.58,109.09 91.31,110.36 U16.2 87,110.36 R39.2 ; 92.58,109.09 U16.6
$7N1366: length 6.2
  Top Layer w0.508: LED7.2 133.09,32.77 R46.1
$7N1428: length 13.2
  Top Layer w0.508: Q5.3 v1(126.49,35.31)
  Bottom Layer w0.508: v1(126.49,35.31) LED7.1

## Text on the board
Top Silkscreen Layer: OFF - ON | Flashing | Anti-Restart | Current-Warning | Jim Heaney, RIT SHED Makerspace | Access Control AC Power Switch | Licensed CERN-OHL-S 2.0 | Version 3.0.1 | May 2026
